# EAGLE schematic Tube Screamer Schematic (EAGLE 9.6.2)
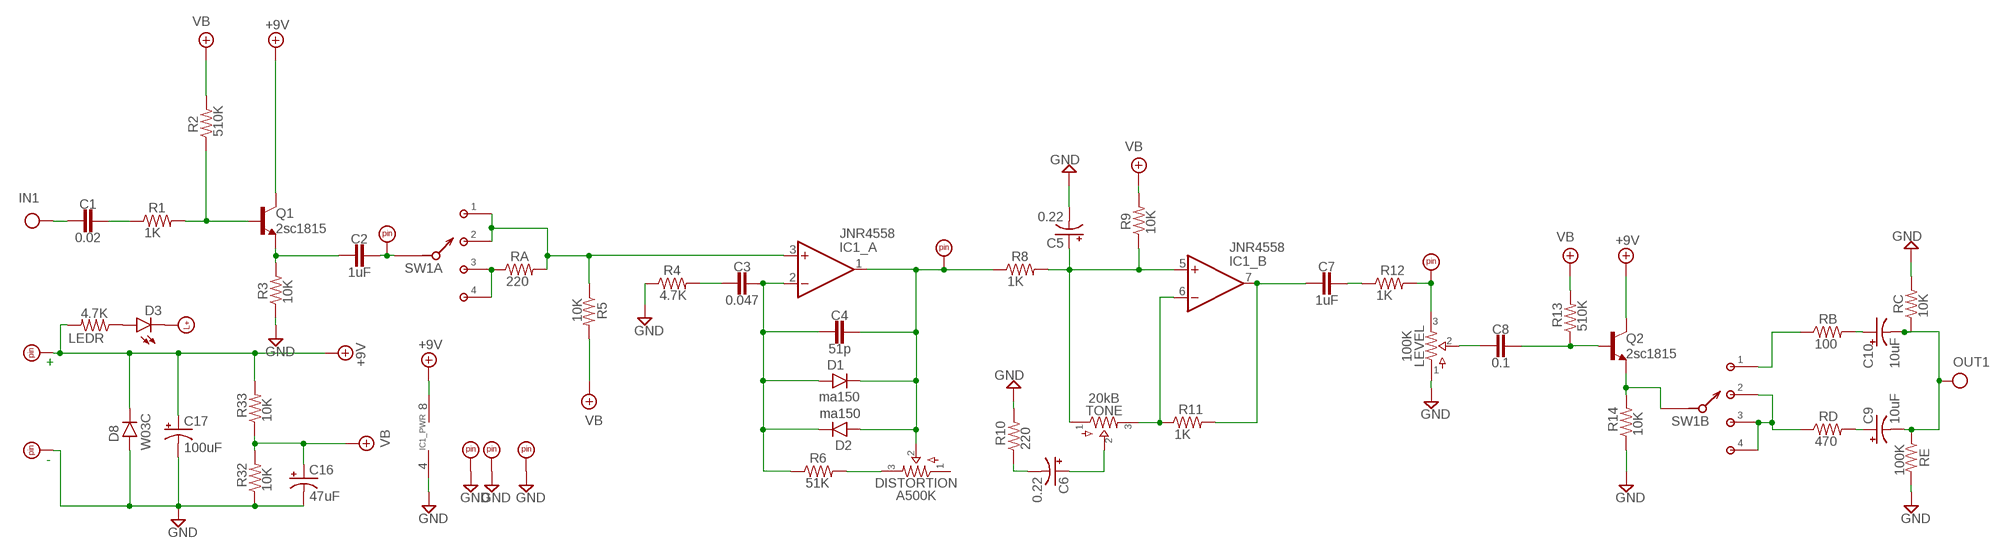
[diagram p0: schematic, sheet 1]

## Parts
C1  0.02  CAP.3  [0.2".MED]
C2  1uF  CAP.4  [0.2".LRG]
C3  0.047  CAP.3  [0.2".MED]
C4  51p  CAP.3  [0.2".MED]
C5  0.22  0501  [050_020_1]
C6  0.22  0501  [050_020_1]
C7  1uF  CAP.4  [0.2".LRG]
C8  0.1  CAP.3  [0.2".MED]
C9  10uF  0501  [050_020_1]
C10  10uF  0501  [050_020_1]
C16  47uF  0501  [050_020_1]
C17  100uF  0501  [050_020_1]
D1  ma150  DO41.3  [DO41-3]
D2  ma150  DO41.3  [DO41-3]
D3  LED3MM  [LED3MM]
D8  W03C  DO35.3  [DO35-3]
DISTORTION  A500K  16MM.1  [16MM_B.MOUNT]
IC1  JNR4558  DUALTH  [DIL08]
IN1  IN  [SQUARE]
LEDR  4.7K  RESISTORS.3B  [R0207/3]
LEVEL  100K  16MM.1  [16MM_B.MOUNT]
OUT1  OUT  [SQUARE]
Q1  2sc1815  2SC945  [TO92]
Q2  2sc1815  2SC945  [TO92]
R1  1K  RESISTORS.3B  [R0207/3]
R2  510K  RESISTORS.3B  [R0207/3]
R3  10K  RESISTORS.3B  [R0207/3]
R4  4.7K  RESISTORS.3B  [R0207/3]
R5  10K  RESISTORS.3B  [R0207/3]
R6  51K  RESISTORS.3B  [R0207/3]
R8  1K  RESISTORS.3B  [R0207/3]
R9  10K  RESISTORS.3B  [R0207/3]
R10  220  RESISTORS.3B  [R0207/3]
R11  1K  RESISTORS.3B  [R0207/3]
R12  1K  RESISTORS.3B  [R0207/3]
R13  510K  RESISTORS.3B  [R0207/3]
R14  10K  RESISTORS.3B  [R0207/3]
R32  10K  RESISTORS.3B  [R0207/3]
R33  10K  RESISTORS.3B  [R0207/3]
RA  220  RESISTORS.3B  [R0207/3]
RB  100  RESISTORS.3B  [R0207/3]
RC  10K  RESISTORS.3B  [R0207/3]
RD  470  RESISTORS.3B  [R0207/3]
RE  100K  RESISTORS.3B  [R0207/3]
SW1  2P4TMINIROTARY  [2P4T.MINI]
TONE  20kB  16MM.1  [16MM_B.MOUNT]
U$1  PADS.RND_NL  [PAD2]
U$2  PADS.RND_NL  [PAD2]
U$3  PADS.RND_NL  [PAD2]
U$4  PADS.RND_NL  [PAD2]
U$5  PADS.RND_NL  [PAD2]
U$6  PADS.RND_NL  [PAD2]
U$7  LED+  [SQUARE]
U$8  PADS.RND_NL  [PAD2]
U$9  PADS.RND_NL  [PAD2]

## Nets
+9V: C17.+ D8.C IC1.8(_PWR:V+) LEDR.2 Q1.2(C) Q2.2(C) R33.2 U$1.P$1
GND: C5.- C16.- C17.- D8.A IC1.4(_PWR:V-) LEVEL.1 R3.1 R4.1 R10.2 R14.1 R32.1 RC.2 RE.2 U$2.P$1 U$3.P$1 U$4.P$1 U$5.P$1
IN: C1.2 IN1.1(IN)
N$1: C1.1 R1.1
N$2: Q1.1(B) R1.2 R2.1
N$3: C2.1 SW1.A(A:A) U$6.P$1
N$4: C2.2 Q1.3(E) R3.2
N$5: RA.1 SW1.A3 SW1.A4
N$6: IC1.3(_A:+IN) R5.1 RA.2 SW1.A1 SW1.A2
N$7: RD.1 SW1.B2 SW1.B3 SW1.B4
N$8: C3.1 C4.2 D1.A D2.C IC1.2(_A:-IN) R6.1
N$9: C3.2 R4.2
N$10: C4.1 D1.C D2.A DISTORTION.2 IC1.1(_A:OUT) R8.1 U$8.P$1
N$11: DISTORTION.3 R6.2
N$12: C5.+ IC1.5(_B:+IN) R8.2 R9.1 TONE.1
N$13: IC1.6(_B:-IN) R11.1 TONE.3
N$14: C7.2 IC1.7(_B:OUT) R11.2
N$15: C6.+ TONE.2
N$16: C6.- R10.1
N$17: C7.1 R12.1
N$18: LEVEL.3 R12.2 U$9.P$1
N$19: C8.2 LEVEL.2
N$20: C8.1 Q2.1(B) R13.1
N$21: Q2.3(E) R14.2 SW1.B(B:A)
N$22: RB.1 SW1.B1
N$23: D3.K(C) U$7.1
N$24: C9.+ RD.2
N$25: C10.+ RB.2
N$26: D3.A LEDR.1
OUT: C9.- C10.- OUT1.1(OUT) RC.1 RE.1
VB: C16.+ R2.2 R5.2 R9.2 R13.2 R32.2 R33.1
Unconnected: DISTORTION.1

## Notes on the sheet
- +
- -

## Library data of the parts
C1-C4 C7 C8 = caps-film:CAP: For Ceramic, Film, MLCC caps
C5 C6 C9 C10 C16 C17 = caps-elec:050: 0.22 - 100uF Xicon values at Mouser.com: 10V: 10 - 100uF; 16V: 2.2 - 47uF; 25V: 0.47 - 47uF; 50V: 0.22 - 22uF
D1 D2 = diodes:DO41: DO-41 Package Diodes: 1N4001 - 1N40019 Zener Diodes: 1N4728 - 1N4764
D3 = diodes:LED
D8 = diodes:DO35: DO-35 Package Diodes: 1N914
DISTORTION LEVEL TONE = potentiometers:16MM: 16mm Poteniometers
IC1 = integrated circuits:DUAL: OP AMP
IN1 = supply pins:IN: Input obsolete: use Mark instead and label net schematic input label without circuit board terminal/pad labels net "IN" provided as complement to OUT (rarely used)
LEDR R1-R6 R8-R14 R32 R33 RA RB RC RD RE = resistors:RESISTORS
OUT1 = supply pins:OUT: Output obsolete: use Mark instead and label net output label without circuit board terminal/pad commonly used as output label on 2nd lug of a potentiometer
Q1 Q2 = transistors-BJT:2SC945: NPN [B]-C-E pinout 2sc945: http://smallbear-electronics.mybigcommerce.com/transistor-nec-2sc945/
SW1 = switches:2P4T
U$1-U$6 U$8 U$9 = supply pins:PADS.: Pads For I/O connections or test point pads on PCBs.
U$7 = supply pins:LED+